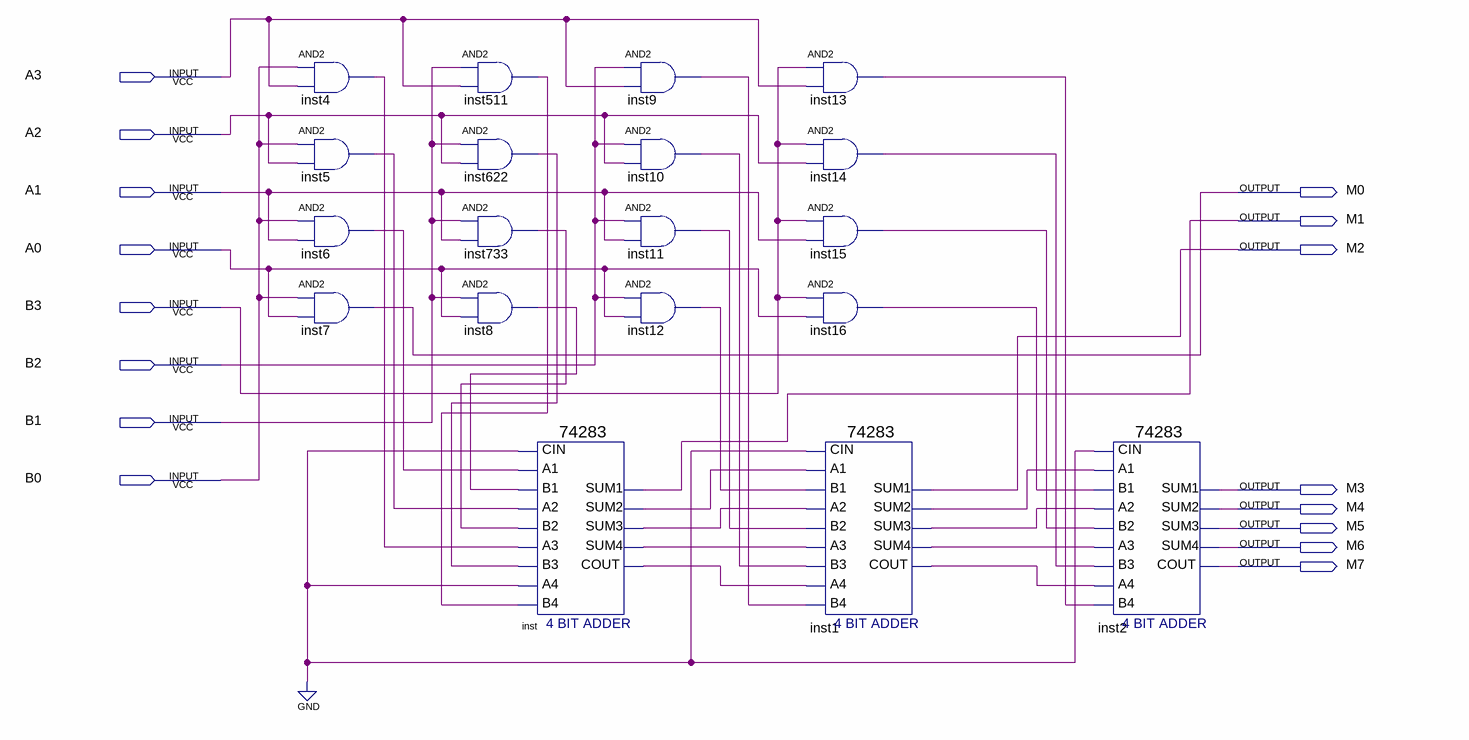
[diagram p0: schematic sheet]
// Quartus schematic mul4.bdf as structural Verilog: 19 symbols, 16 pins
module mul4 (
  input  A3,
  input  A2,
  input  A1,
  input  A0,
  input  B3,
  input  B2,
  input  B1,
  input  B0,
  output M0,
  output M1,
  output M2,
  output M3,
  output M4,
  output M5,
  output M6,
  output M7
);

  wire inst1_cout, inst1_sum2, inst1_sum3, inst1_sum4, inst4_out, inst5_out, inst6_out, inst8_out, inst9_out,
       inst10_out, inst11_out, inst12_out, inst13_out, inst14_out, inst15_out, inst16_out, inst511_out,
       inst622_out, inst733_out, inst_cout, inst_sum2, inst_sum3, inst_sum4;

  and inst4 (inst4_out, B0, A3);
  and inst5 (inst5_out, B0, A2);
  and inst6 (inst6_out, B0, A1);
  and inst7 (M0, B0, A0);
  and inst511 (inst511_out, B1, A3);
  and inst622 (inst622_out, B1, A2);
  and inst733 (inst733_out, B1, A1);
  and inst8 (inst8_out, B1, A0);
  \74283  inst (
    .CIN(1'b0), .A1(inst6_out), .A2(inst5_out), .B2(inst733_out), .A3(inst4_out), .A4(1'b0),
    .B4(inst511_out), .B1(inst8_out), .B3(inst622_out), .SUM4(inst_sum4), .COUT(inst_cout), .SUM1(M1),
    .SUM2(inst_sum2), .SUM3(inst_sum3));
  and inst9 (inst9_out, B2, A3);
  and inst10 (inst10_out, B2, A2);
  and inst11 (inst11_out, B2, A1);
  and inst12 (inst12_out, B2, A0);
  and inst13 (inst13_out, B3, A3);
  and inst14 (inst14_out, B3, A2);
  and inst15 (inst15_out, B3, A1);
  and inst16 (inst16_out, B3, A0);
  \74283  inst1 (
    .CIN(1'b0), .A1(inst_sum2), .A2(inst_sum3), .B2(inst11_out), .A3(inst_sum4), .A4(inst_cout),
    .B4(inst9_out), .B1(inst12_out), .B3(inst10_out), .SUM4(inst1_sum4), .COUT(inst1_cout), .SUM1(M2),
    .SUM2(inst1_sum2), .SUM3(inst1_sum3));
  \74283  inst2 (
    .CIN(1'b0), .A1(inst1_sum2), .A2(inst1_sum3), .B2(inst15_out), .A3(inst1_sum4), .A4(inst1_cout),
    .B4(inst13_out), .B1(inst16_out), .B3(inst14_out), .SUM4(M6), .COUT(M7), .SUM1(M3), .SUM2(M4), .SUM3(M5));
endmodule
